# EAGLE design sunrise_alarmclock (EAGLE 7.5.0)
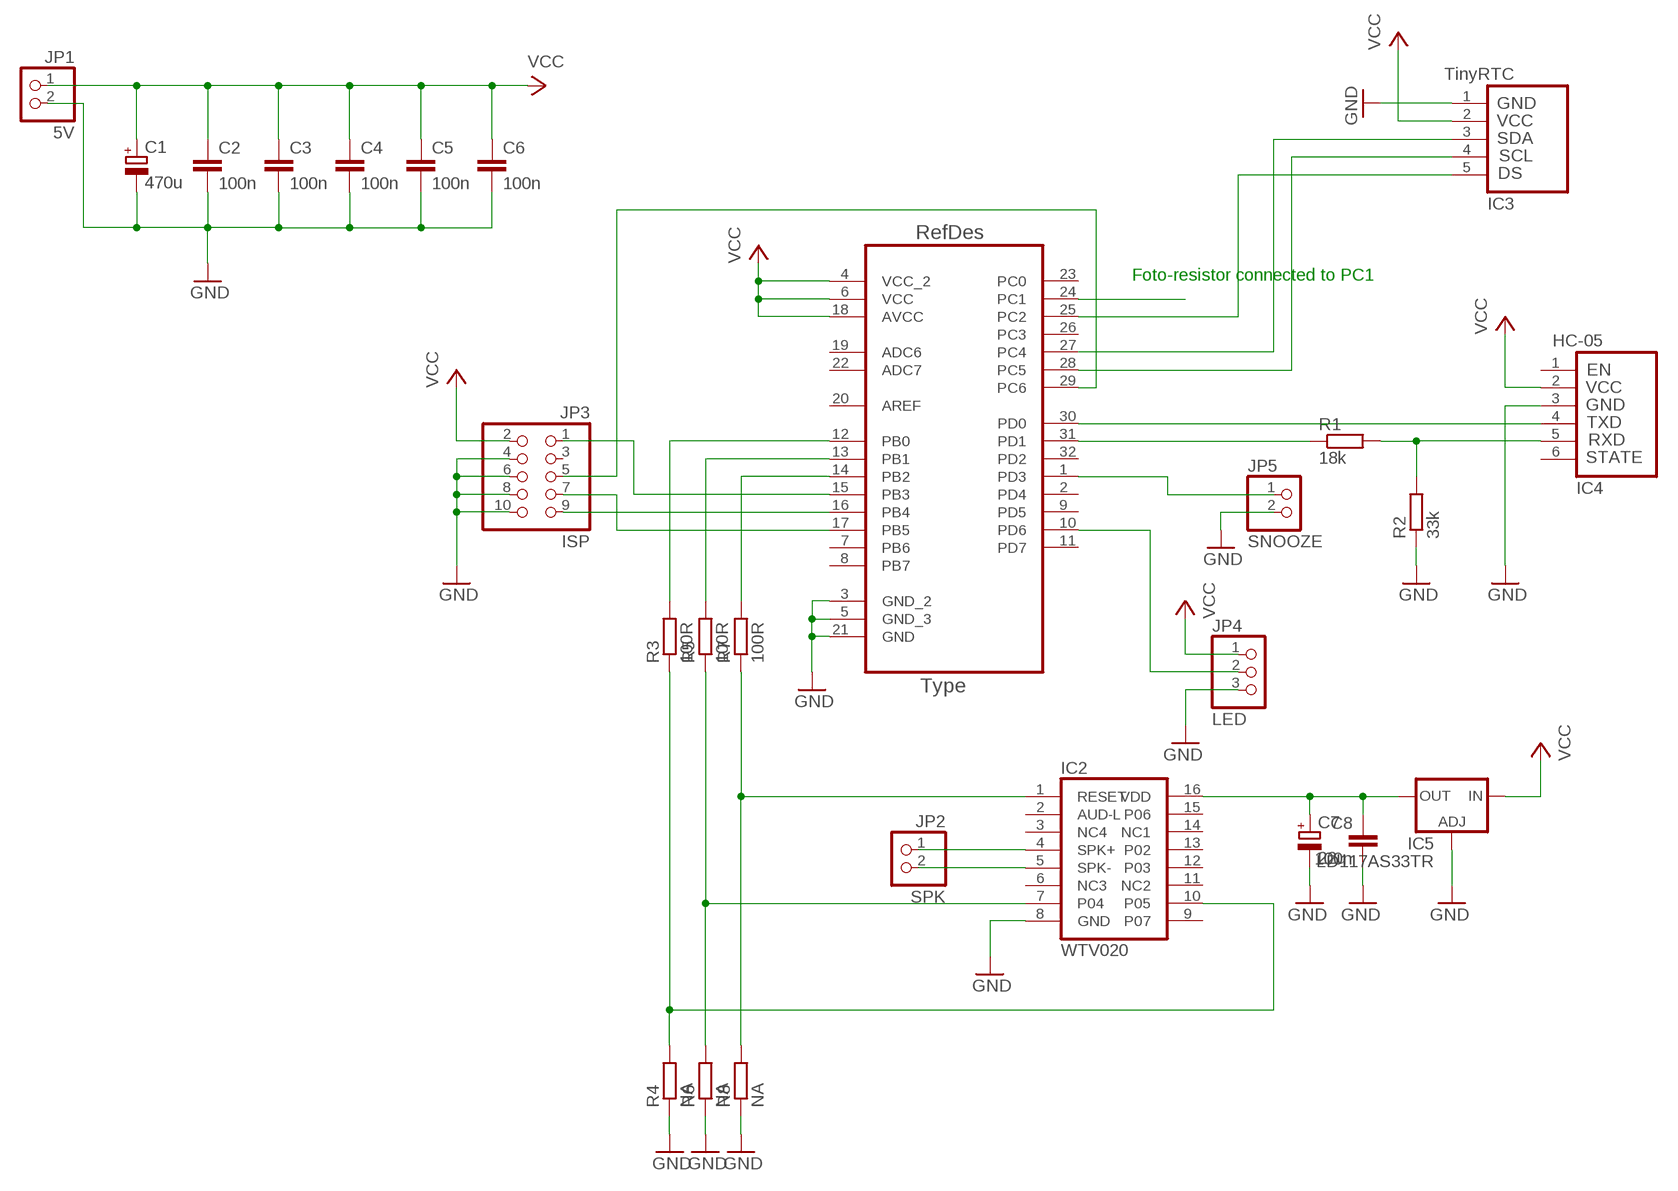
[diagram p0: schematic, sheet 1]

## Parts
C1  470u  CPOL-EUD/7343-31W  [D/7343-31W]
C2  100n  C-EUC1206K  [C1206K]
C3  100n  C-EUC1206K  [C1206K]
C4  100n  C-EUC1206K  [C1206K]
C5  100n  C-EUC1206K  [C1206K]
C6  100n  C-EUC1206K  [C1206K]
C7  22u  CPOL-EUC/6032-28R  [C/6032-28R]
C8  100n  C-EUC1206K  [C1206K]
IC1  ATMEGA328P  ATMEGA328P-AU  [QFP80P900X900X120-32N]
IC2  WTV020  [DIL16-6]
IC3  TinyRTC  HC-05  [HC-05]
IC4  HC-05  [HC-05]
IC5  LD117AS33TR  [SOT223]
JP1  5V  PINHD-1X2  [1X02]
JP2  SPK  PINHD-1X2  [1X02]
JP3  ISP  PINHD-2X5  [2X05]
JP4  LED  PINHD-1X3  [1X03]
JP5  SNOOZE  PINHD-1X2  [1X02]
R1  18k  R-EU_M1206  [M1206]
R2  33k  R-EU_M1206  [M1206]
R3  100R  R-EU_M1206  [M1206]
R4  NA  R-EU_M1206  [M1206]
R5  100R  R-EU_M1206  [M1206]
R6  NA  R-EU_M1206  [M1206]
R7  100R  R-EU_M1206  [M1206]
R8  NA  R-EU_M1206  [M1206]

## Nets
GND: C1.- C2.2 C3.2 C4.2 C5.2 C6.2 C7.- C8.2 IC1.3(GND_2) IC1.5(GND_3) IC1.21(GND) IC2.8(GND) IC3.1(GND) IC4.3(GND) IC5.1(ADJ) JP1.2 JP3.4 JP3.6 JP3.8 JP3.10 JP4.3 JP5.2 R2.1 R4.1 R6.1 R8.1
N$1: IC1.15(PB3) JP3.1
N$2: IC1.29(PC6) JP3.5
N$3: IC1.17(PB5) JP3.7
N$4: IC1.16(PB4) JP3.9
N$5: IC1.31(PD1) R1.1
N$6: IC4.5(RXD) R1.2 R2.2
N$7: IC2.4(SPK+) JP2.1
N$8: IC1.28(PC5) IC3.4(SCL)
N$9: IC1.27(PC4) IC3.3(SDA)
N$10: IC2.5(SPK-) JP2.2
N$11: IC2.1(RESET) R7.1 R8.2
N$12: IC1.30(PD0) IC4.4(TXD)
N$13: IC2.7(P04) R5.1 R6.2
N$14: IC2.10(P05) R3.1 R4.2
N$15: IC1.12(PB0) R3.2
N$16: IC1.25(PC2) IC3.5(DS)
N$17: C7.+ C8.1 IC2.16(VDD) IC5.4(OUT)
N$18: IC1.13(PB1) R5.2
N$19: IC1.14(PB2) R7.2
N$20: IC1.10(PD6) JP4.2
N$21: IC1.1(PD3) JP5.1
N$22: IC1.24(PC1)
VCC: C1.+ C2.1 C3.1 C4.1 C5.1 C6.1 IC1.4(VCC_2) IC1.6(VCC) IC1.18(AVCC) IC3.2(VCC) IC4.2(VCC) IC5.3(IN) JP1.1 JP3.2 JP4.1
Unconnected: IC1.2(PD4) IC1.7(PB6) IC1.8(PB7) IC1.9(PD5) IC1.11(PD7) IC1.19(ADC6) IC1.20(AREF) IC1.22(ADC7) IC1.23(PC0) IC1.26(PC3) IC1.32(PD2) IC2.2(AUD-L) IC2.3(NC4) IC2.6(NC3) IC2.9(P07) IC2.11(NC2) IC2.12(P03) IC2.13(P02) IC2.14(NC1) IC2.15(P06) IC4.1(EN) IC4.6(STATE) JP3.3

## Notes on the sheet
- Foto-resistor connected to PC1

## Library data of the parts
C1 C7 = rcl:CPOL-EU: POLARIZED CAPACITOR, European symbol
C2-C6 C8 = rcl:C-EU: CAPACITOR, European symbol
IC1 = Atmel-ATMEGA328P-AU:ATMEGA328P-AU; DESCRIPTION: 8-bit Microcontroller with In-System Programmable Flash; MPN: ATMEGA328P-AU; OC_FARNELL: 1715486; OC_NEWARK: 14R4631; PACKAGE: TQFP-32; SUPPLIER: Atmel
IC2 = lpatiny:WTV020: Audio module
IC3 = TinyRTC_module:HC-05: FEMALE HEADER; OC_FARNELL: unknown; OC_NEWARK: unknown
IC4 = HC-05_module:HC-05: FEMALE HEADER; OC_FARNELL: unknown; OC_NEWARK: unknown
IC5 = v-reg:LD117A?*: Low drop fixed and adjustable positive voltage regulators 1 A Source: http://www.st.com/stonline/products/literature/ds/7194/ld1117axx.pdf
JP1 JP2 JP5 = pinhead:PINHD-1X2: PIN HEADER
JP3 = pinhead:PINHD-2X5: PIN HEADER
JP4 = pinhead:PINHD-1X3: PIN HEADER
R1-R8 = rcl:R-EU_: RESISTOR, European symbol

## Board
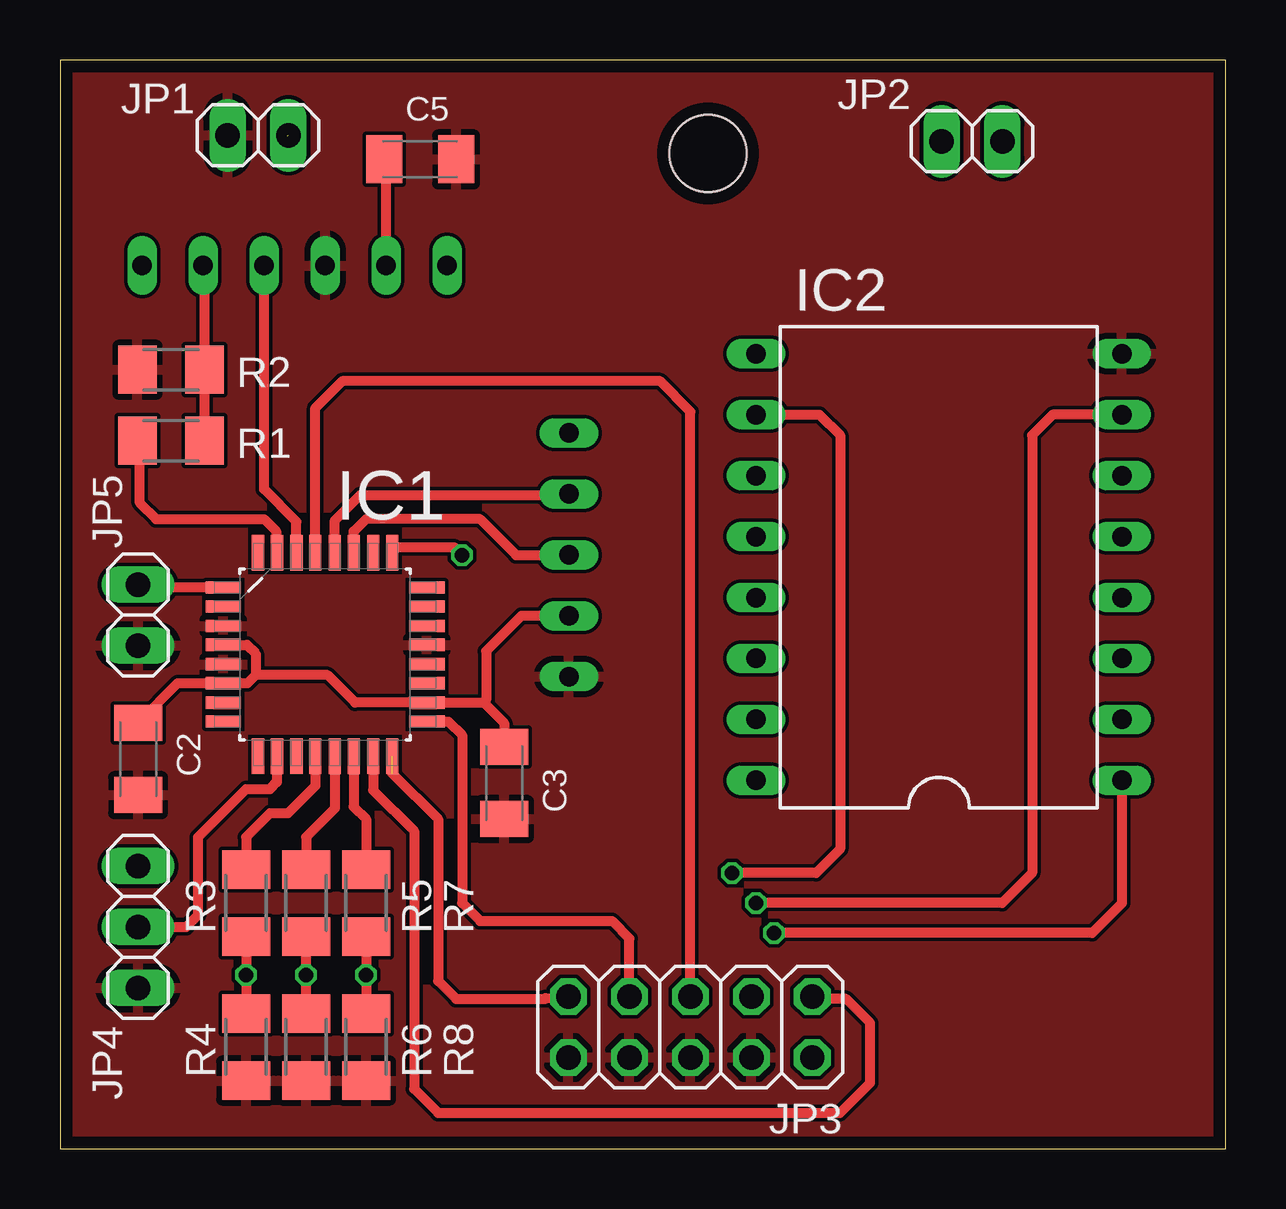
[diagram p1: board, top side]
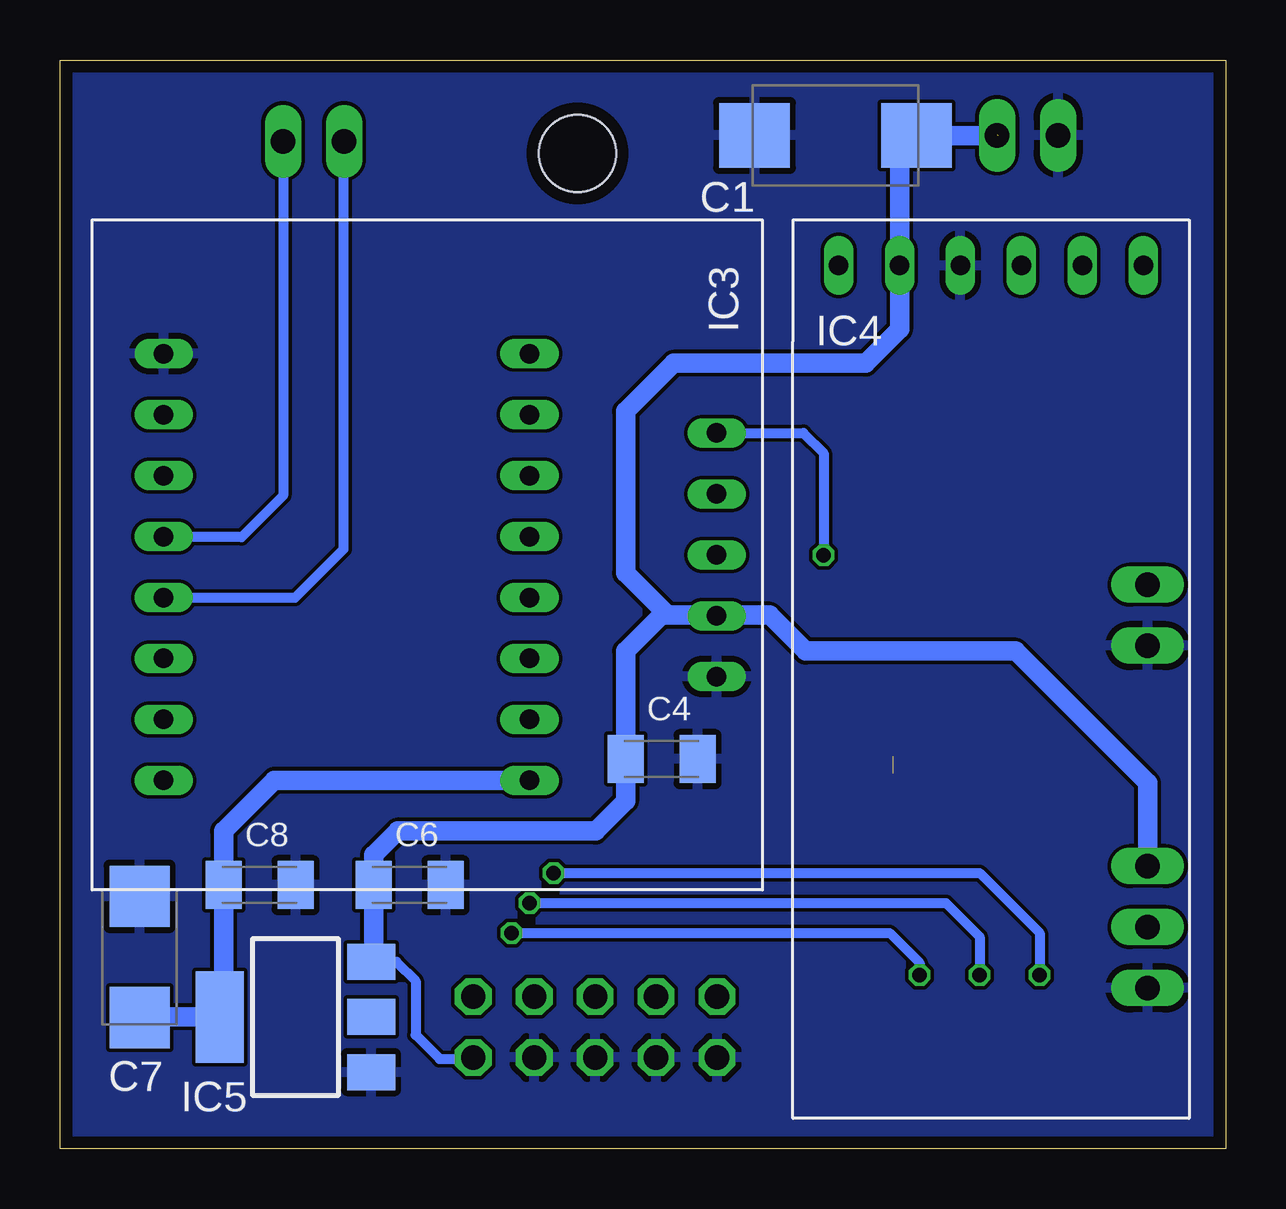
[diagram p2: board, bottom side, seen from below]

Size 48.56 x 45.39 mm. Coordinates in mm from the lower left corner, seen from the top.
Outline: 0,0 48.56,0 48.56,45.39 0,45.39 0,0
Copper layers (1*16): Top 0.035mm / dielectric 1.6mm / Bottom 0.035mm
Design rules "Elecrow_2-layer_PCB_eagle_rule": minimum track width 6mil, minimum drill 12mil, track to track 6mil, track to pad 8mil, pad to pad 12mil, via to via 12mil, smd to smd 0mil, copper to edge 20mil, drill to drill 10mil, minimum pad ring 6mil, minimum via ring 6mil, stop-mask expansion 0mil, vias tented up to drill 100mil, thermal gap 10mil
Holes 3.2 mm at 27,41.5

### Footprints (pad centres in the part's own frame; a part is rotated, then mirrored left to right if it is on the bottom)
D/7343-31W = smd 2.95 x 2.7: + 3.375,0; - -3.375,0
C1206K = smd 1.5 x 2: 1 -1.5,0; 2 1.5,0
C/6032-28R = smd 2.55 x 2.5: + 2.525,0; - -2.525,0
QFP80P900X900X120-32N = smd 1.473 x 0.508: 1 -4.242,2.794; 2 -4.242,2.007; 3 -4.242,1.194; 4 -4.242,0.406; 5 -4.242,-0.406; 6 -4.242,-1.194; 7 -4.242,-2.007; 8 -4.242,-2.794; 17 4.242,-2.794; 18 4.242,-2.007; 19 4.242,-1.194; 20 4.242,-0.406; 21 4.242,0.406; 22 4.242,1.194; 23 4.242,2.007; 24 4.242,2.794 | smd 0.508 x 1.473: 9 -2.794,-4.242; 10 -2.007,-4.242; 11 -1.194,-4.242; 12 -0.406,-4.242; 13 0.406,-4.242; 14 1.194,-4.242; 15 2.007,-4.242; 16 2.794,-4.242; 25 2.794,4.242; 26 2.007,4.242; 27 1.194,4.242; 28 0.406,4.242; 29 -0.406,4.242; 30 -1.194,4.242; 31 -2.007,4.242; 32 -2.794,4.242
DIL16-6 = drill 0.813 long: 1 -13.97,-7.62; 2 -11.43,-7.62; 3 -8.89,-7.62; 4 -6.35,-7.62; 5 -3.81,-7.62; 6 -1.27,-7.62; 7 1.27,-7.62; 8 3.81,-7.62; 9 3.81,7.62; 10 1.27,7.62; 11 -1.27,7.62; 12 -3.81,7.62; 13 -6.35,7.62; 14 -8.89,7.62; 15 -11.43,7.62; 16 -13.97,7.62
HC-05 = drill 0.813 long: 1 5.08,0; 2 2.54,0; 3 0,0; 4 -2.54,0; 5 -5.08,0
HC-05' = drill 0.813 long: 1 -6.35,0; 2 -3.81,0; 3 -1.27,0; 4 1.27,0; 5 3.81,0; 6 6.35,0
SOT223 = smd 1.5 x 2: 1 -2.3,-3.15; 2 0,-3.15; 3 2.3,-3.15 | smd 3.8 x 2: 4 0,3.15
1X02 = drill 1.016 long: 1 -1.27,0; 2 1.27,0
2X05 = drill 1.016 octagon: 1 -5.08,-1.27; 2 -5.08,1.27; 3 -2.54,-1.27; 4 -2.54,1.27; 5 0,-1.27; 6 0,1.27; 7 2.54,-1.27; 8 2.54,1.27; 9 5.08,-1.27; 10 5.08,1.27
1X03 = drill 1.016 long: 1 -2.54,0; 2 0,0; 3 2.54,0
M1206 = smd 1.6 x 2: 1 -1.4,0; 2 1.4,0

### Placement (x,y rotation side)
C1  16.25,42.25 0 bottom
C2  3.25,16.25 270 top
C3  18.5,15.25 270 top
C4  23.5,16.25 0 bottom
C5  15,41.25 0 top
C6  34,11 0 bottom
C7  45.25,8 270 bottom
C8  40.25,11 0 bottom
IC1  11.04,20.61 0 top
IC2  36.62,29.34 90 top
IC3  21.2,24.77 270 bottom
IC4  HC-05  [HC-05']  9.78,36.83 0 bottom
IC5  38.75,5.5 90 bottom
JP1  8.25,42.25 180 top
JP2  38,42 0 top
JP3  26.27,5.08 180 top
JP4  3.25,9.25 270 top
JP5  3.25,22.25 270 top
R1  4.63,29.52 0 top
R2  4.63,32.48 0 top
R3  7.75,10.25 90 top
R4  7.75,4.25 90 top
R5  10.25,10.25 90 top
R6  10.25,4.25 90 top
R7  12.75,10.25 90 top
R8  12.75,4.25 90 top

### Tracks (layer width: path | path; a pad name or v marks a point on that pad's centre or on a via)
GND
  pour Bottom: 0,0 48.5,0 48.5,45.5 0,45.5
  pour Top: 0,0 48.5,0 48.5,45.5 0,45.5
N$1
  Top 0.406: IC1.15 13.05,14.95 14.75,13.25 14.75,2.5 15.75,1.5 32.5,1.5 33.75,2.75 33.75,5.25 32.75,6.25 31.45,6.25 JP3.1
N$2
  Top 0.406: IC1.29 10.64,30.89 11.75,32 25,32 26.27,30.73 JP3.5
N$3
  Top 0.406: JP3.7 23.73,8.78 23,9.5 17.5,9.5 16.75,10.25 16.75,17.25 16.18,17.82 IC1.17
N$4  (1 unrouted)
  Top 0.406: 19.84,6.25 20.23,6.28 | 20.23,6.28 JP3.9 | 20.23,6.28 20.2,6.25 16.5,6.25 15.75,7 15.75,13.75 13.84,15.66
N$5
  Top 0.406: IC1.31 9,24.89 9,25.75 8.5,26.25 4,26.25 3.33,26.93 3.33,29.42 R1.1
N$6
  Top 0.406: IC4.5 6.03,36.77 R2.2 R1.2
N$7
  Bottom 0.406: IC2.4 38.77,22.98 36.75,25 36.75,41.98 JP2.1
N$8
  Top 0.406: IC1.28 11.45,26.2 12.5,27.25 21.15,27.25 IC3.4
N$9
  Top 0.406: IC1.27 12.24,25.74 12.75,26.25 17.5,26.25 19,24.75 21.19,24.75 IC3.3
N$10
  Bottom 0.406: JP2.2 39.27,27.23 41,25.5 44.22,25.5 IC2.5
N$11  (via drill 0.6)
  Top 0.406: R8.2 v12.75,7.25 R7.1 | IC2.1 44.24,10.24 43,9 v29.75,9
  Bottom 0.406: v29.75,9 14,9 12.75,7.75 v12.75,7.25
N$12
  Top 0.406: IC4.4 8.5,27.5 9.85,26.15 IC1.30
N$13  (via drill 0.6)
  Top 0.406: R6.2 v10.25,7.25 R5.1 | IC2.7 41.35,30.61 40.5,29.75 40.5,11.5 39.25,10.25 v29,10.25
  Bottom 0.406: v29,10.25 11.65,10.25 R5.1 v10.25,7.25
N$14  (via drill 0.6)
  Top 0.406: R3.1 v7.75,7.25 R4.2 | IC2.10 31.64,30.61 32.5,29.75 32.5,12.5 31.5,11.5 v28,11.5
  Bottom 0.406: v28,11.5 10.25,11.5 7.75,9 v7.75,7.25
N$15
  Top 0.406: IC1.12 10.64,15.14 9.5,14 8.75,14 7.75,13 R3.2
N$16  (via drill 0.6)
  Top 0.406: IC1.25 13.84,25.09 16.41,25.09 v16.75,24.75
  Bottom 0.406: IC3.5 17.59,29.84 16.75,29 v16.75,24.75
N$17
  Bottom 0.813: IC2.16 39.63,15.37 41.75,13.25 C8.1 41.75,5.5 IC5.4 45.25,5.5 C7.+
N$18
  Top 0.406: IC1.13 11.45,14.2 10.25,13 R5.2
N$19
  Top 0.406: IC1.14 12.24,14.26 12.75,13.75 R7.2
N$20
  Top 0.406: IC1.10 9.04,15.29 8.75,15 7.75,15 5.75,13 5.75,9.75 5.25,9.25 JP4.2
N$21
  Top 0.406: IC1.1 3.37,23.4 JP5.1
VCC  (1 unrouted)
  Top 0.406: 8.15,19.75 7.82,19.42 IC1.6 4.92,19.42 C2.1 | IC1.4 7.78,21.02 8.15,20.65 8.15,19.75 | 8.15,19.75 11.15,19.75 12.3,18.6 IC1.18 17.65,18.6 | IC4.2 13.59,41.16 C5.1 | 17.65,18.6 18.5,17.75 C3.1 | IC3.2 19.23,22.23 17.75,20.75 17.75,18.71 17.65,18.6
  Bottom 0.406: IC5.3 34.55,7.8 33.75,7 33.75,4.75 32.75,3.75 31.41,3.75 JP3.2
  Bottom 0.813: 23.25,22.25 25,24 25,30.75 23,32.75 15,32.75 13.59,34.16 IC4.2 13.59,41.54 C1.+ 12.88,42.23 9.46,42.23 | 23.25,22.25 21.23,22.25 IC3.2 21.18,22.25 19,22.25 17.5,20.75 8.75,20.75 3.25,15.25 JP4.1 | 23.25,22.25 23.5,22.25 25,20.75 C4.1 25,14.5 26.25,13.25 34.5,13.25 35.5,12.25 C6.1 35.5,8.05 IC5.3